# EAGLE schematic automatic battery charger circuit (EAGLE 6.1)
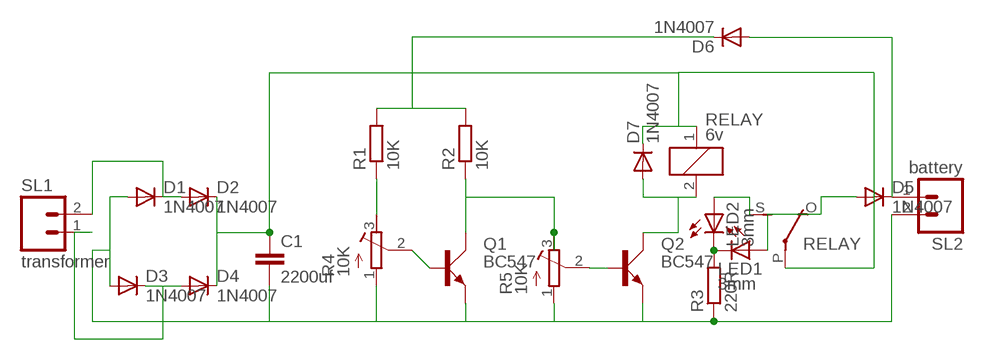
[diagram p0: schematic, sheet 1]

## Parts
C1  2200uf  C5/5.5  [C5B5.5]
D1  1N4007  1N4004  [DO41-10]
D2  1N4007  1N4004  [DO41-10]
D3  1N4007  1N4004  [DO41-10]
D4  1N4007  1N4004  [DO41-10]
D5  1N4007  1N4004  [DO41-10]
D6  1N4007  1N4004  [DO41-10]
D7  1N4007  1N4004  [DO41-10]
LED1  3mm  LED3MM  [LED3MM]
LED2  3mm  LED3MM  [LED3MM]
Q1  BC547  [SOT54A]
Q2  BC547  [SOT54A]
R1  10K  R-EU_0204/7  [0204/7]
R2  10K  R-EU_0204/7  [0204/7]
R3  220R  R-EU_0204/7  [0204/7]
R4  10K  R-TRIMM3339P  [RTRIM3339P]
R5  10K  R-TRIMM3339P  [RTRIM3339P]
RELAY  6v  G5LE  [G5LE]
SL1  transformer  M02  [02P]
SL2  battery  M02  [02P]

## Nets
N$1: D1.C D2.A SL1.2
N$2: D3.C D4.A SL1.1
N$3: C1.2 D1.A D3.A Q1.E Q2.E R3.1 R4.1(A) R5.1(A) SL2.2
N$4: C1.1 D2.C D4.C D7.C RELAY.1 RELAY.P(2:P)
N$6: Q1.B R4.2(S)
N$7: R1.1 R4.3(E)
N$8: Q1.C R2.1 R5.3(E)
N$9: Q2.B R5.2(S)
N$10: D6.C R1.2 R2.2
N$11: D5.A LED1.A RELAY.O(2:O)
N$12: D7.A Q2.C RELAY.2
N$14: D5.C D6.A SL2.1
N$15: LED1.K(C) LED2.K(C) R3.2
N$16: LED2.A RELAY.S(2:S)

## Library data of the parts
C1 = capacitor-wima:C: CAPACITOR naming: grid - package width
D1-D7 = diode:1N4004: DIODE general purpose rectifier, 1 A
LED1 LED2 = led:LED: LED OSRAM: - CHIPLED LG R971, LG N971, LY N971, LG Q971, LY Q971, LO R971, LY R971 LH N974, LH R974 LS Q976, LO Q976, LY Q976 LO Q996 - Hyper CHIPLED LW Q18S LB Q993, LB Q99A, LB R99A - SideLED LS A670, LO A670, LY A670, LG A670, LP A670 LB A673, LV A673, LT A673, LW A673 LH A674 LY A675 LS A676, LA A676, LO A676, LY A676, LW A676 LS A679, LY A679, LG A679 - Hyper Micro SIDELED® LS Y876, LA Y876, LO Y876, LY Y876 LT Y87S - SmartLED LW L88C, LW L88S LB L89C, LB L89S, LG L890 LS L89K, LO L89K, LY L89K LS L896, LA L896, LO L896, LY L896 - TOPLED LS T670, LO T670, LY T670, LG T670, LP T670 LSG T670, LSP T670, LSY T670, LOP T670, LYG T670 LG T671, LOG T671, LSG T671 LB T673, LV T673, LT T673, LW T673 LH T674 LS T676, LA T676, LO T676, LY T676, LB T676, LH T676, LSB T676, LW T676 LB T67C, LV T67C, LT T67C, LS T67K, LO T67K, LY T67K, LW E67C LS E67B, LA E67B, LO E67B, LY E67B, LB E67C, LV E67C, LT E67C LW T67C LS T679, LY T679, LG T679 LS T770, LO T770, LY T770, LG T770, LP T770 LB T773, LV T773, LT T773, LW T773 LH T774 LS E675, LA E675, LY E675, LS T675 LS T776, LA T776, LO T776, LY T776, LB T776 LHGB T686 LT T68C, LB T68C - Hyper Mini TOPLED® LB M676 - Mini TOPLED Santana® LG M470 LS M47K, LO M47K, LY M47K Source: http://www.osram.convergy.de LUXEON: - LUMILED® LXK2-PW12-R00, LXK2-PW12-S00, LXK2-PW14-U00, LXK2-PW14-V00 LXK2-PM12-R00, LXK2-PM12-S00, LXK2-PM14-U00 LXK2-PE12-Q00, LXK2-PE12-R00, LXK2-PE12-S00, LXK2-PE14-T00, LXK2-PE14-U00 LXK2-PB12-K00, LXK2-PB12-L00, LXK2-PB12-M00, LXK2-PB14-N00, LXK2-PB14-P00, LXK2-PB14-Q00 LXK2-PR12-L00, LXK2-PR12-M00, LXK2-PR14-Q00, LXK2-PR14-R00 LXK2-PD12-Q00, LXK2-PD12-R00, LXK2-PD12-S00 LXK2-PH12-R00, LXK2-PH12-S00 LXK2-PL12-P00, LXK2-PL12-Q00, LXK2-PL12-R00 Source: www.luxeon.com KINGBRIGHT: KA-3528ASYC Source: www.kingbright.com
Q1 Q2 = transistor-small-signal:BC547: NPN TRANSISTOR
R1-R3 = resistor:R-EU_: RESISTOR, European symbol
R4 R5 = rcl:R-TRIMM: Trimm resistor
RELAY = relay:G5LE: RELAY 1 x switch, 10 A/120 V AC, 8 A/30 V DC, Omron; OC_FARNELL: unknown; OC_NEWARK: unknown
SL1 SL2 = con-amp-quick:M02: AMP QUICK CONNECTOR; OC_FARNELL: unknown; OC_NEWARK: unknown